# EAGLE design SPIDERnew (EAGLE 9.4.2)
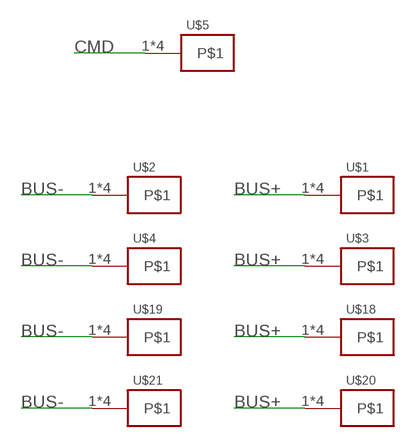
[diagram p0: schematic, sheet 1]

## Parts
U$1  KCONNECT-  [KCONNECT-]
U$2  KCONNECT-  [KCONNECT-]
U$3  KCONNECT-  [KCONNECT-]
U$4  KCONNECT-  [KCONNECT-]
U$5  KCONNECTQUAD-  [KCONNECT-_QUAD]
U$18  KCONNECT-  [KCONNECT-]
U$19  KCONNECT-  [KCONNECT-]
U$20  KCONNECT-  [KCONNECT-]
U$21  KCONNECT-  [KCONNECT-]

## Nets
BUS+: U$1.1 U$1.2 U$1.3 U$1.4 U$3.1 U$3.2 U$3.3 U$3.4 U$18.1 U$18.2 U$18.3 U$18.4 U$20.1 U$20.2 U$20.3 U$20.4
BUS-: U$2.1 U$2.2 U$2.3 U$2.4 U$4.1 U$4.2 U$4.3 U$4.4 U$19.1 U$19.2 U$19.3 U$19.4 U$21.1 U$21.2 U$21.3 U$21.4
CMD: U$5.1 U$5.2 U$5.3 U$5.4

## Library data of the parts
U$1-U$5 U$18-U$21 = CanCubeSat:KCONNECT

## Board
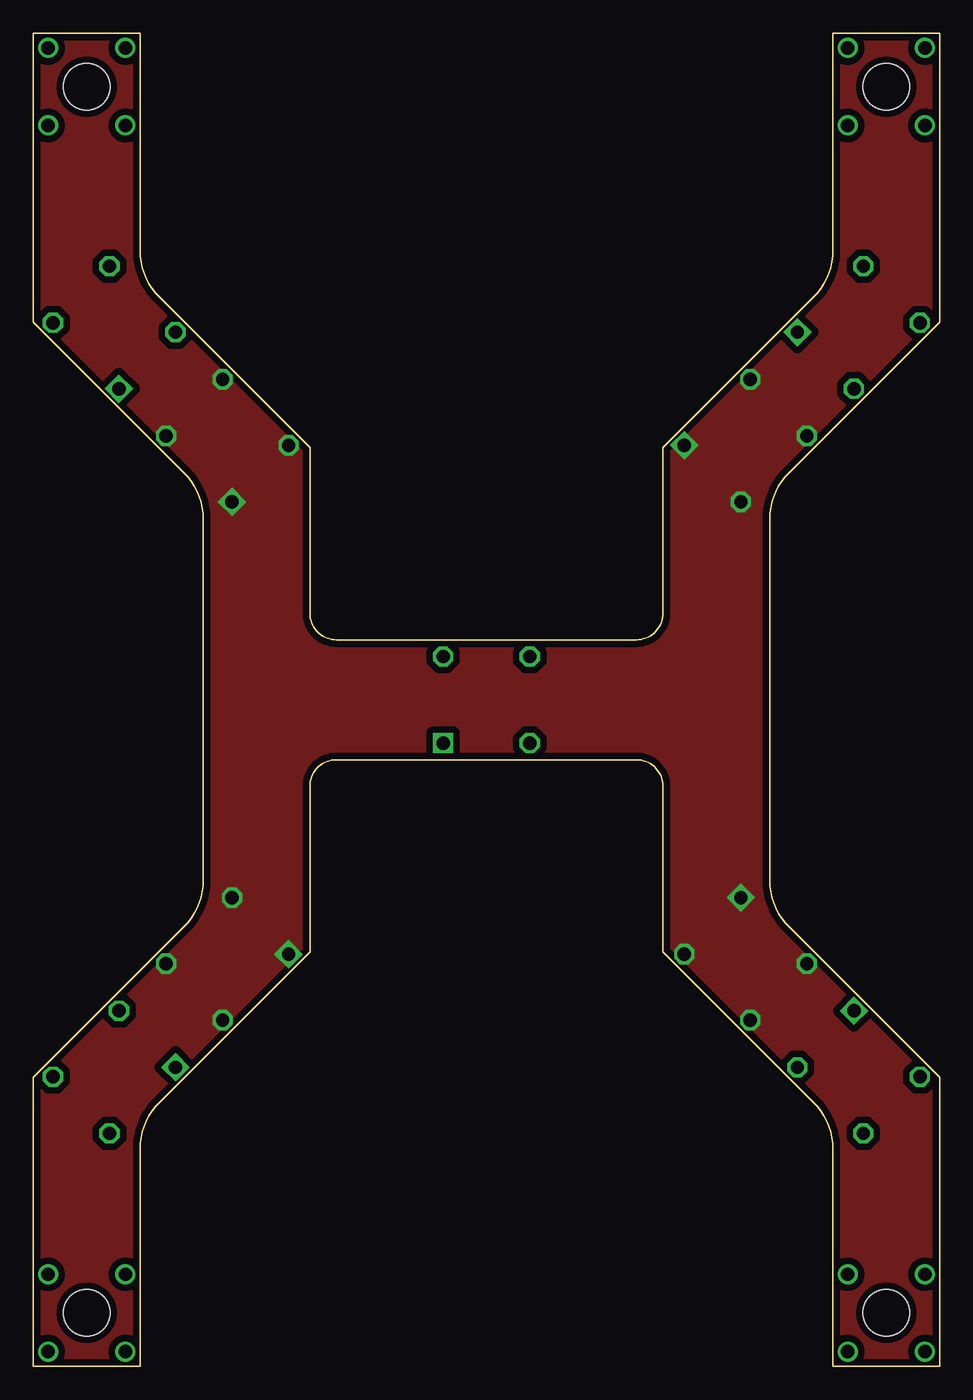
[diagram p1: board, top side]
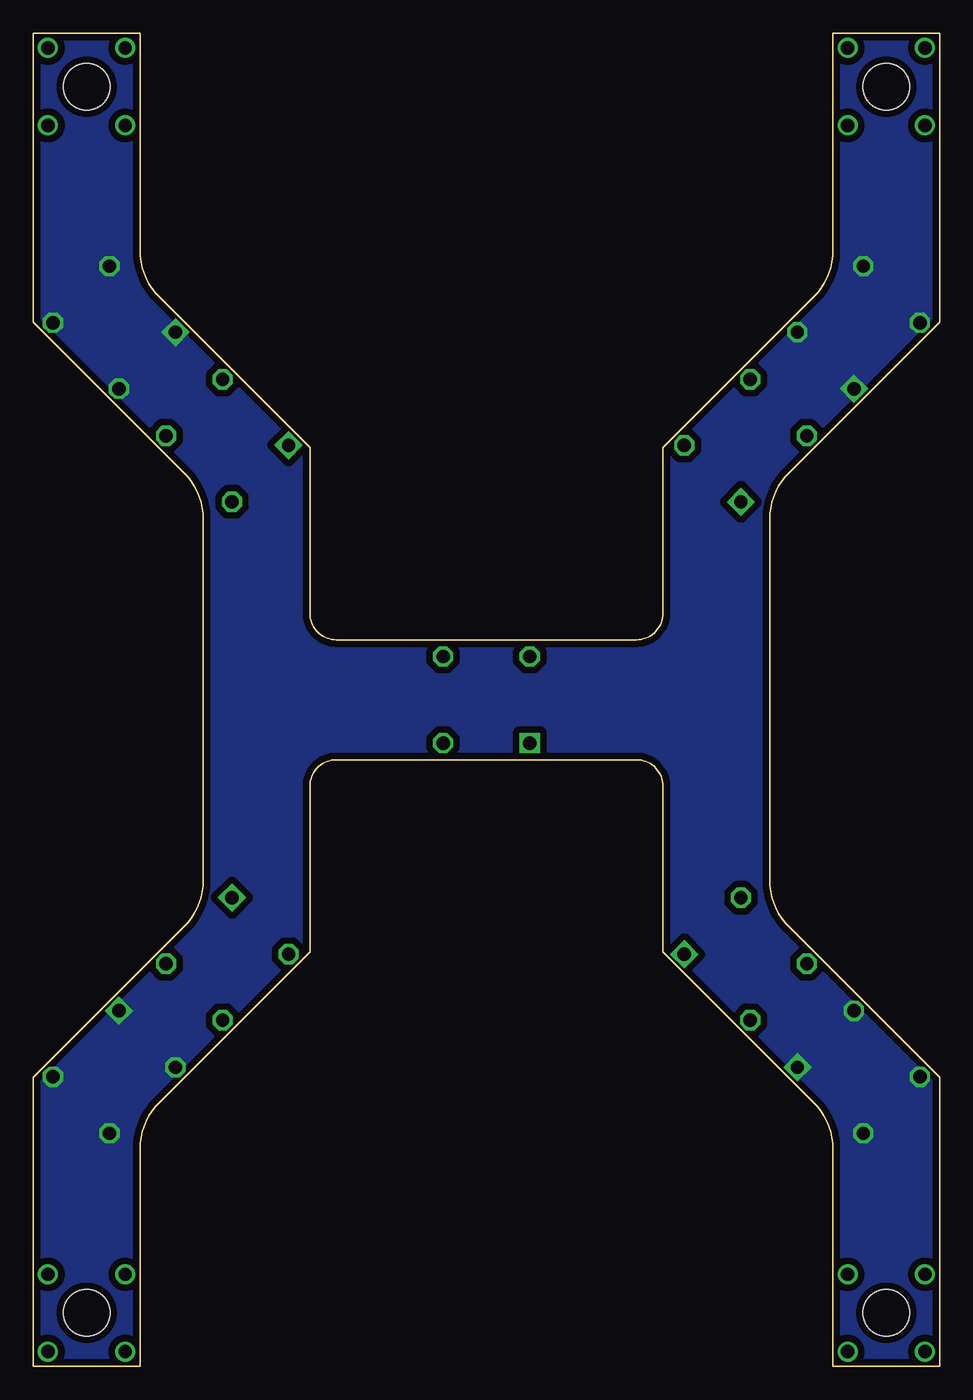
[diagram p2: board, bottom side, seen from below]

Size 68 x 100 mm. Coordinates in mm from the lower left corner, seen from the top.
Outline: 0,0 8,0 8,16.27 arc-45 9.46,19.81 20.75,31.09 20.75,43.5 arc-90 22.75,45.5 45.25,45.5 arc-90 47.25,43.5 47.25,31.09 58.54,19.81 arc-45 60,16.27 60,0 68,0 68,21.66 56.71,32.94 arc-45 55.25,36.48 55.25,63.52 arc-45 56.71,67.06 68,78.34 68,100 60,100 60,83.73 arc-45 58.54,80.19 47.25,68.91 47.25,56.5 arc-90 45.25,54.5 22.75,54.5 arc-90 20.75,56.5 20.75,68.91 9.46,80.19 arc-45 8,83.73 8,100 0,100 0,78.34 11.29,67.06 arc-45 12.75,63.52 12.75,36.48 arc-45 11.29,32.94 0,21.66 0,0
Copper layers (1*16): Top 0.035mm / dielectric 1.5mm / Bottom 0.035mm
Design rules "default *": minimum track width 0.25mil, minimum drill 0.35mm, track to track 0.2mm, track to pad 0.2mm, pad to pad 0.2mm, via to via 0.2mm, smd to smd 0.2mm, copper to edge 0.19mm, drill to drill 0.1mm, minimum pad ring 10mil, minimum via ring 8mil, stop-mask expansion 4mil, vias tented up to drill 0mil, thermal gap 10mil
Holes 3.5 mm at 4,4 64,4 64,96 4,96

### Footprints (pad centres in the part's own frame; a part is rotated, then mirrored left to right if it is on the bottom)
KCONNECT- = drill 1 pad 1.4 square: 1 -3,-3.5 | drill 1 pad 1.4 octagon: 2 -3,3.5; 3 3,-3.5; 4 3,3.5
KCONNECT-_QUAD = drill 1 pad 1.4 square: 1 -3.25,-3.25 | drill 1 pad 1.4 octagon: 2 -3.25,3.25; 3 3.25,-3.25; 4 3.25,3.25

### Placement (x,y rotation side)
U$1  6.07,77.93 45 top
U$2  14.55,69.44 45 top
U$3  61.93,77.93 315 top
U$4  53.45,69.44 315 top
U$5  34,50 0 top
U$18  6.07,22.07 135 top
U$19  14.55,30.55 135 top
U$20  61.93,22.07 225 top
U$21  53.45,30.55 225 top

### Tracks (layer width: path | path; a pad name or v marks a point on that pad's centre or on a via)
BUS+
  pour Bottom (isolate 0.5, no thermals): 0,100 8,100 8,83.5 8.12,82.5 8.5,81.5 9.17,80.48 34.03,55.7 58.84,80.47 59.44,81.44 59.87,82.5 60,83.47 60.01,99.99 68,99.99 68,78.33 56.46,66.81 56.89,32.76 68.02,21.63 67.99,0.01 60,0 60,16.48 59.84,17.58 59.34,18.77 58.78,19.56 34.18,44.11 21.27,31.61 9.1,19.43 8.67,18.75 8.34,18.07 8.08,17.07 8,16.38 8,0 0.02,-0.01 0,19.48 0,21.63 1.61,23.27 3.12,24.76 11.79,33.44 11.61,66.75 1.26,77.1 0,78.34
BUS-
  pour Top (isolate 0.5, no thermals): 0,100 8,100 8,83.5 8.12,82.5 8.5,81.5 9.17,80.48 34.03,55.7 58.84,80.47 59.44,81.44 59.87,82.5 60,83.47 60.01,99.99 68,99.99 68,78.33 56.17,66.5 56.4,63.55 56.4,33.25 68,21.65 68,0.01 60,0 60,16.48 59.84,17.58 59.34,18.77 58.78,19.56 45.79,32.52 34.19,44.12 21.27,31.61 9.1,19.43 8.67,18.75 8.34,18.07 8.08,17.07 8,16.38 8,0 0.02,-0.01 0,19.48 0,21.63 1.61,23.27 3.12,24.76 11.76,33.41 11.76,66.59 1.26,77.1 0,78.34
N$4  (via drill 1)
  other vias: 1.1,6.9
N$5  (via drill 1)
  other vias: 1.1,1.1
N$6  (via drill 1)
  other vias: 6.9,1.1
N$7  (via drill 1)
  other vias: 6.9,6.9
N$10  (via drill 1)
  other vias: 61.1,6.9
N$11  (via drill 1)
  other vias: 61.1,1.1
N$12  (via drill 1)
  other vias: 66.9,1.1
N$13  (via drill 1)
  other vias: 66.9,6.9
N$14  (via drill 1)
  other vias: 61.1,98.9
N$15  (via drill 1)
  other vias: 61.1,93.1
N$16  (via drill 1)
  other vias: 66.9,93.1
N$17  (via drill 1)
  other vias: 66.9,98.9
N$18  (via drill 1)
  other vias: 1.1,98.9
N$19  (via drill 1)
  other vias: 1.1,93.1
N$20  (via drill 1)
  other vias: 6.9,93.1
N$21  (via drill 1)
  other vias: 6.9,98.9